# Altium schematic sheet Analog Inputs.SchDoc: Ravage - Analog Inputs
size A3; Address1: Drawn By:; Address2: Dan Visser; DocumentNumber: A; Revision: 0.2
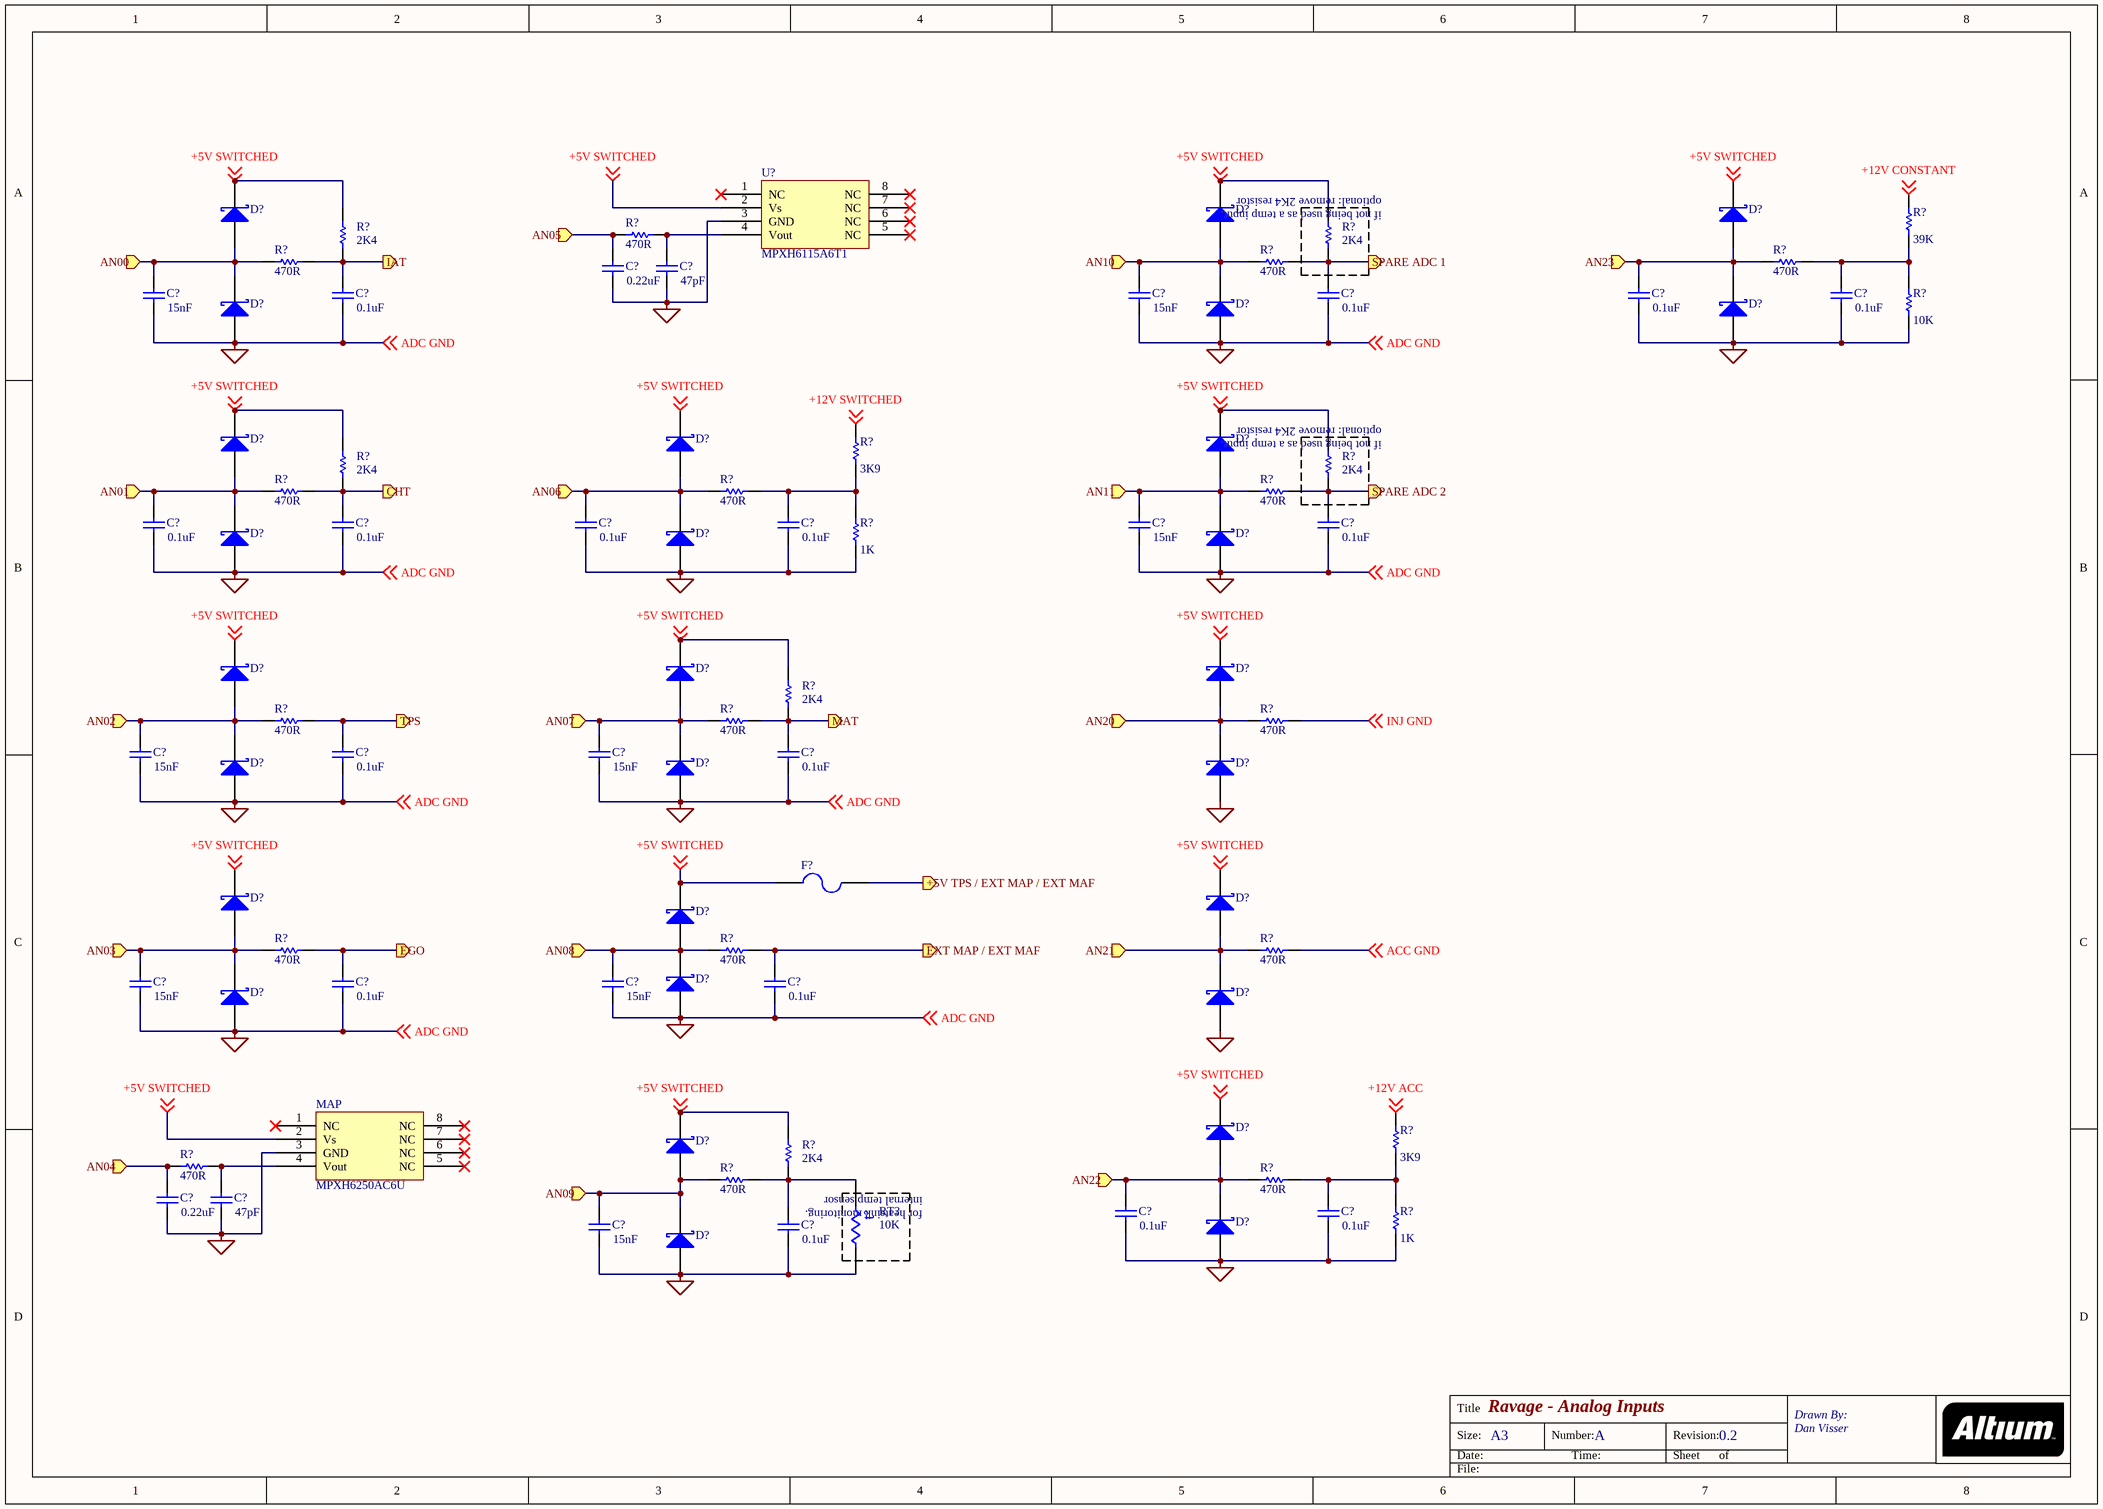
[diagram p0: Analog Inputs.SchDoc]

## Parts
(Parts that share a designator on the sheet are numbered #1, #2 ... from top to bottom, then left to right.)
C?#1  value 0.22uF  [RAD-0.3]
C?#2  value 47pF  [RAD-0.3]
C?#3  value 15nF  [RAD-0.3]
C?#4  value 0.1uF  [RAD-0.3]
C?#5  value 15nF  [RAD-0.3]
C?#6  value 0.1uF  [RAD-0.3]
C?#7  value 0.1uF  [RAD-0.3]
C?#8  value 0.1uF  [RAD-0.3]
C?#9  value 0.1uF  [RAD-0.3]
C?#10  value 0.1uF  [RAD-0.3]
C?#11  value 0.1uF  [RAD-0.3]
C?#12  value 0.1uF  [RAD-0.3]
C?#13  value 15nF  [RAD-0.3]
C?#14  value 0.1uF  [RAD-0.3]
C?#15  value 15nF  [RAD-0.3]
C?#16  value 0.1uF  [RAD-0.3]
C?#17  value 15nF  [RAD-0.3]
C?#18  value 0.1uF  [RAD-0.3]
C?#19  value 15nF  [RAD-0.3]
C?#20  value 0.1uF  [RAD-0.3]
C?#21  value 15nF  [RAD-0.3]
C?#22  value 0.1uF  [RAD-0.3]
C?#23  value 0.22uF  [RAD-0.3]
C?#24  value 47pF  [RAD-0.3]
C?#25  value 0.1uF  [RAD-0.3]
C?#26  value 0.1uF  [RAD-0.3]
C?#27  value 15nF  [RAD-0.3]
C?#28  value 0.1uF  [RAD-0.3]
D?#1  (no value)  [TO-220AC]
D?#2  (no value)  [TO-220AC]
D?#3  (no value)  [TO-220AC]
D?#4  (no value)  [TO-220AC]
D?#5  (no value)  [TO-220AC]
D?#6  (no value)  [TO-220AC]
D?#7  (no value)  [TO-220AC]
D?#8  (no value)  [TO-220AC]
D?#9  (no value)  [TO-220AC]
D?#10  (no value)  [TO-220AC]
D?#11  (no value)  [TO-220AC]
D?#12  (no value)  [TO-220AC]
D?#13  (no value)  [TO-220AC]
D?#14  (no value)  [TO-220AC]
D?#15  (no value)  [TO-220AC]
D?#16  (no value)  [TO-220AC]
D?#17  (no value)  [TO-220AC]
D?#18  (no value)  [TO-220AC]
D?#19  (no value)  [TO-220AC]
D?#20  (no value)  [TO-220AC]
D?#21  (no value)  [TO-220AC]
D?#22  (no value)  [TO-220AC]
D?#23  (no value)  [TO-220AC]
D?#24  (no value)  [TO-220AC]
D?#25  (no value)  [TO-220AC]
D?#26  (no value)  [TO-220AC]
D?#27  (no value)  [TO-220AC]
D?#28  (no value)  [TO-220AC]
F?  (no value)  [PIN-W2/E2.8]
MAP  MPXH6250AC6U
R?#1  value 2K4  [AXIAL-0.3]
R?#2  value 470R  [AXIAL-0.3]
R?#3  value 2K4  [AXIAL-0.3]
R?#4  value 39K  [AXIAL-0.3]
R?#5  value 470R  [AXIAL-0.3]
R?#6  value 470R  [AXIAL-0.3]
R?#7  value 470R  [AXIAL-0.3]
R?#8  value 10K  [AXIAL-0.3]
R?#9  value 2K4  [AXIAL-0.3]
R?#10  value 2K4  [AXIAL-0.3]
R?#11  value 3K9  [AXIAL-0.3]
R?#12  value 470R  [AXIAL-0.3]
R?#13  value 470R  [AXIAL-0.3]
R?#14  value 470R  [AXIAL-0.3]
R?#15  value 1K  [AXIAL-0.3]
R?#16  value 2K4  [AXIAL-0.3]
R?#17  value 470R  [AXIAL-0.3]
R?#18  value 470R  [AXIAL-0.3]
R?#19  value 470R  [AXIAL-0.3]
R?#20  value 470R  [AXIAL-0.3]
R?#21  value 470R  [AXIAL-0.3]
R?#22  value 470R  [AXIAL-0.3]
R?#23  value 2K4  [AXIAL-0.3]
R?#24  value 470R  [AXIAL-0.3]
R?#25  value 3K9  [AXIAL-0.3]
R?#26  value 470R  [AXIAL-0.3]
R?#27  value 470R  [AXIAL-0.3]
R?#28  value 1K  [AXIAL-0.3]
RT?  10K  [6-0805_N]
U?  MPXH6115A6T1

## Ports
+5V TPS / EXT MAP / EXT MAF (out), AN00 (in), AN01 (in), AN02 (in), AN03 (in), AN04 (in), AN05 (in), AN06 (in), AN07 (in), AN08 (in), AN09 (in), AN10 (in), AN11 (in), AN20 (in), AN21 (in), AN22 (in), AN23 (in), CHT (out), EGO (out), EXT MAP / EXT MAF (out), IAT (out), MAT (out), SPARE ADC 1 (out), SPARE ADC 2 (out), TPS (out)

## Nets
ADC GND: C?#1.1 C?#2.1 C?#3.1 C?#4.1 C?#5.1 C?#6.1 C?#7.1 C?#8.1 C?#9.1 C?#10.1 C?#11.1 C?#12.1 C?#13.1 C?#14.1 C?#15.1 C?#16.1 C?#17.1 C?#18.1 C?#19.1 C?#20.1 C?#21.1 C?#22.1 C?#23.1 C?#24.1 C?#25.1 C?#26.1 C?#27.1 C?#28.1 D?#4.3(A) D?#5.3(A) D?#6.3(A) D?#10.3(A) D?#11.3(A) D?#12.3(A) D?#16.3(A) D?#17.3(A) D?#18.3(A) D?#22.3(A) D?#23.3(A) D?#24.3(A) D?#27.3(A) D?#28.3(A) MAP.3(GND) R?#8.1 R?#15.1 R?#28.1 RT?.2 U?.3(GND) ; off-sheet ADC GND
+5V SWITCHED: D?#1.1(K) D?#2.1(K) D?#3.1(K) D?#7.1(K) D?#8.1(K) D?#9.1(K) D?#13.1(K) D?#14.1(K) D?#15.1(K) D?#19.1(K) D?#20.1(K) D?#21.1(K) D?#25.1(K) D?#26.1(K) F?.1 MAP.2(Vs) R?#1.1 R?#3.1 R?#9.1 R?#10.1 R?#16.1 R?#23.1 U?.2(Vs) ; off-sheet +5V SWITCHED
+5V TPS / EXT MAP / EXT MAF: F?.2 ; port +5V TPS / EXT MAP / EXT MAF
+12V ACC: R?#25.2 ; off-sheet +12V ACC
+12V CONSTANT: R?#4.2 ; off-sheet +12V CONSTANT
+12V SWITCHED: R?#11.2 ; off-sheet +12V SWITCHED
ACC GND: R?#22.2 ; off-sheet ACC GND
AN00: C?#3.2 D?#1.3(A) D?#4.1(K) R?#5.1 ; port AN00
AN01: C?#9.2 D?#7.3(A) D?#10.1(K) R?#12.1 ; port AN01
AN02: C?#15.2 D?#13.3(A) D?#16.1(K) R?#17.1 ; port AN02
AN03: C?#19.2 D?#19.3(A) D?#23.1(K) R?#20.1 ; port AN03
AN04: C?#23.2 R?#24.1 ; port AN04
AN05: C?#1.2 R?#2.1 ; port AN05
AN06: C?#11.2 D?#8.3(A) D?#11.1(K) R?#13.1 ; port AN06
AN07: C?#17.2 D?#14.3(A) D?#17.1(K) R?#18.1 ; port AN07
AN08: C?#21.2 D?#21.3(A) D?#22.1(K) R?#21.1 ; port AN08
AN09: C?#27.2 D?#26.3(A) D?#28.1(K) R?#26.1 ; port AN09
AN10: C?#5.2 D?#2.3(A) D?#5.1(K) R?#6.1 ; port AN10
AN11: C?#13.2 D?#9.3(A) D?#12.1(K) R?#14.1 ; port AN11
AN20: D?#15.3(A) D?#18.1(K) R?#19.1 ; port AN20
AN21: D?#20.3(A) D?#24.1(K) R?#22.1 ; port AN21
AN22: C?#25.2 D?#25.3(A) D?#27.1(K) R?#27.1 ; port AN22
AN23: C?#7.2 D?#3.3(A) D?#6.1(K) R?#7.1 ; port AN23
CHT: C?#10.2 R?#9.2 R?#12.2 ; port CHT
EGO: C?#20.2 R?#20.2 ; port EGO
EXT MAP / EXT MAF: C?#22.2 R?#21.2 ; port EXT MAP / EXT MAF
IAT: C?#4.2 R?#1.2 R?#5.2 ; port IAT
INJ GND: R?#19.2 ; off-sheet INJ GND
MAT: C?#18.2 R?#16.2 R?#18.2 ; port MAT
SPARE ADC 1: C?#6.2 R?#3.2 R?#6.2 ; port SPARE ADC 1
SPARE ADC 2: C?#14.2 R?#10.2 R?#14.2 ; port SPARE ADC 2
TPS: C?#16.2 R?#17.2 ; port TPS
NetC?#2_2: C?#2.2 R?#2.2 U?.4(Vout)
NetC?#8_2: C?#8.2 R?#4.1 R?#7.2 R?#8.2
NetC?#12_2: C?#12.2 R?#11.1 R?#13.2 R?#15.2
NetC?#24_2: C?#24.2 MAP.4(Vout) R?#24.2
NetC?#26_2: C?#26.2 R?#25.1 R?#27.2 R?#28.2
NetC?#28_2: C?#28.2 R?#23.2 R?#26.2 RT?.1

Not connected (* = marked no-connect by the designer): MAP 1(NC)* 5(NC)* 6(NC)* 7(NC)* 8(NC)*; U? 1(NC)* 5(NC)* 6(NC)* 7(NC)* 8(NC)*

## Notes on the sheet
- optional: remove 2K4 resistor
- if not being used as a temp input.
- internal temp sensor
- for heatsink monitoring.
- Title
- Size:
- Date:
- A3
- Number:
- Time:
- Revision:
- Sheet
- of
- File:
- (in symbol Res Thermal) t°

## Library data of the parts
C?#1-C?#28 = Cap: Capacitor; Published: 8-Jun-2000; LatestRevisionDate: 17-Jul-2002; LatestRevisionNote: Re-released for DXP Platform.; PackageReference: RAD-0.3; Publisher: Altium Limited; PackageDescription: Radial Cap, Thru-Hole; 2 Leads; 0.3 in Pin Spacing
D?#1-D?#28 = Diode 18TQ045: Schottky Rectifier; Note: Terminal 2 is the TAB and is electrically connected to the cathode; Published: 8-Jun-2000; LatestRevisionDate: 17-Jul-2002; LatestRevisionNote: Re-released for DXP Platform.; DatasheetVersion: Dec-1997; PackageVersion: Feb-1998; PackageReference: TO-220AC; Publisher: Altium Limited; PackageDescription: TO, Thru-Hole, Vertical, Heatsink Mounted; 3 In-Line Leads (1 Absent); Pitch 2.54 mm; ComponentLink1Description: Manufacturer Link; ComponentLink1URL: http://www.irf.com/; ComponentLink2Description: Datasheet; ComponentLink2URL: http://www.irf.com/product-info/datasheets/data/18tq.pdf
F? = Fuse 2: Fuse; Published: 8-Jun-2000; LatestRevisionDate: 17-Jul-2002; LatestRevisionNote: Re-released for DXP Platform.; PackageReference: PIN-W2/E2.8; Publisher: Altium Limited; PackageDescription: Thru-Hole; 2 Leads
R?#1-R?#28 = Res1: Resistor; Published: 8-Jun-2000; LatestRevisionDate: 17-Jul-2002; LatestRevisionNote: Re-released for DXP Platform.; PackageReference: AXIAL-0.3; Publisher: Altium Limited; PackageDescription: Axial Device, Thru-Hole; 2 Leads; 0.3 in Pin Spacing
RT? = Res Thermal: Thermistor; Published: 24-Mar-1999; LatestRevisionDate: 29-May-2009; LatestRevisionNote: IPC-7351 Footprint Added.; PackageVersion: Mar-2003; PackageReference: 6-0805; Publisher: Altium Limited; PackageDescription: Chip Resistor 0805 Case Size; Code_IPC: RESC2012